# EAGLE design ESP8266_Led_Driver (EAGLE 9.6.2)
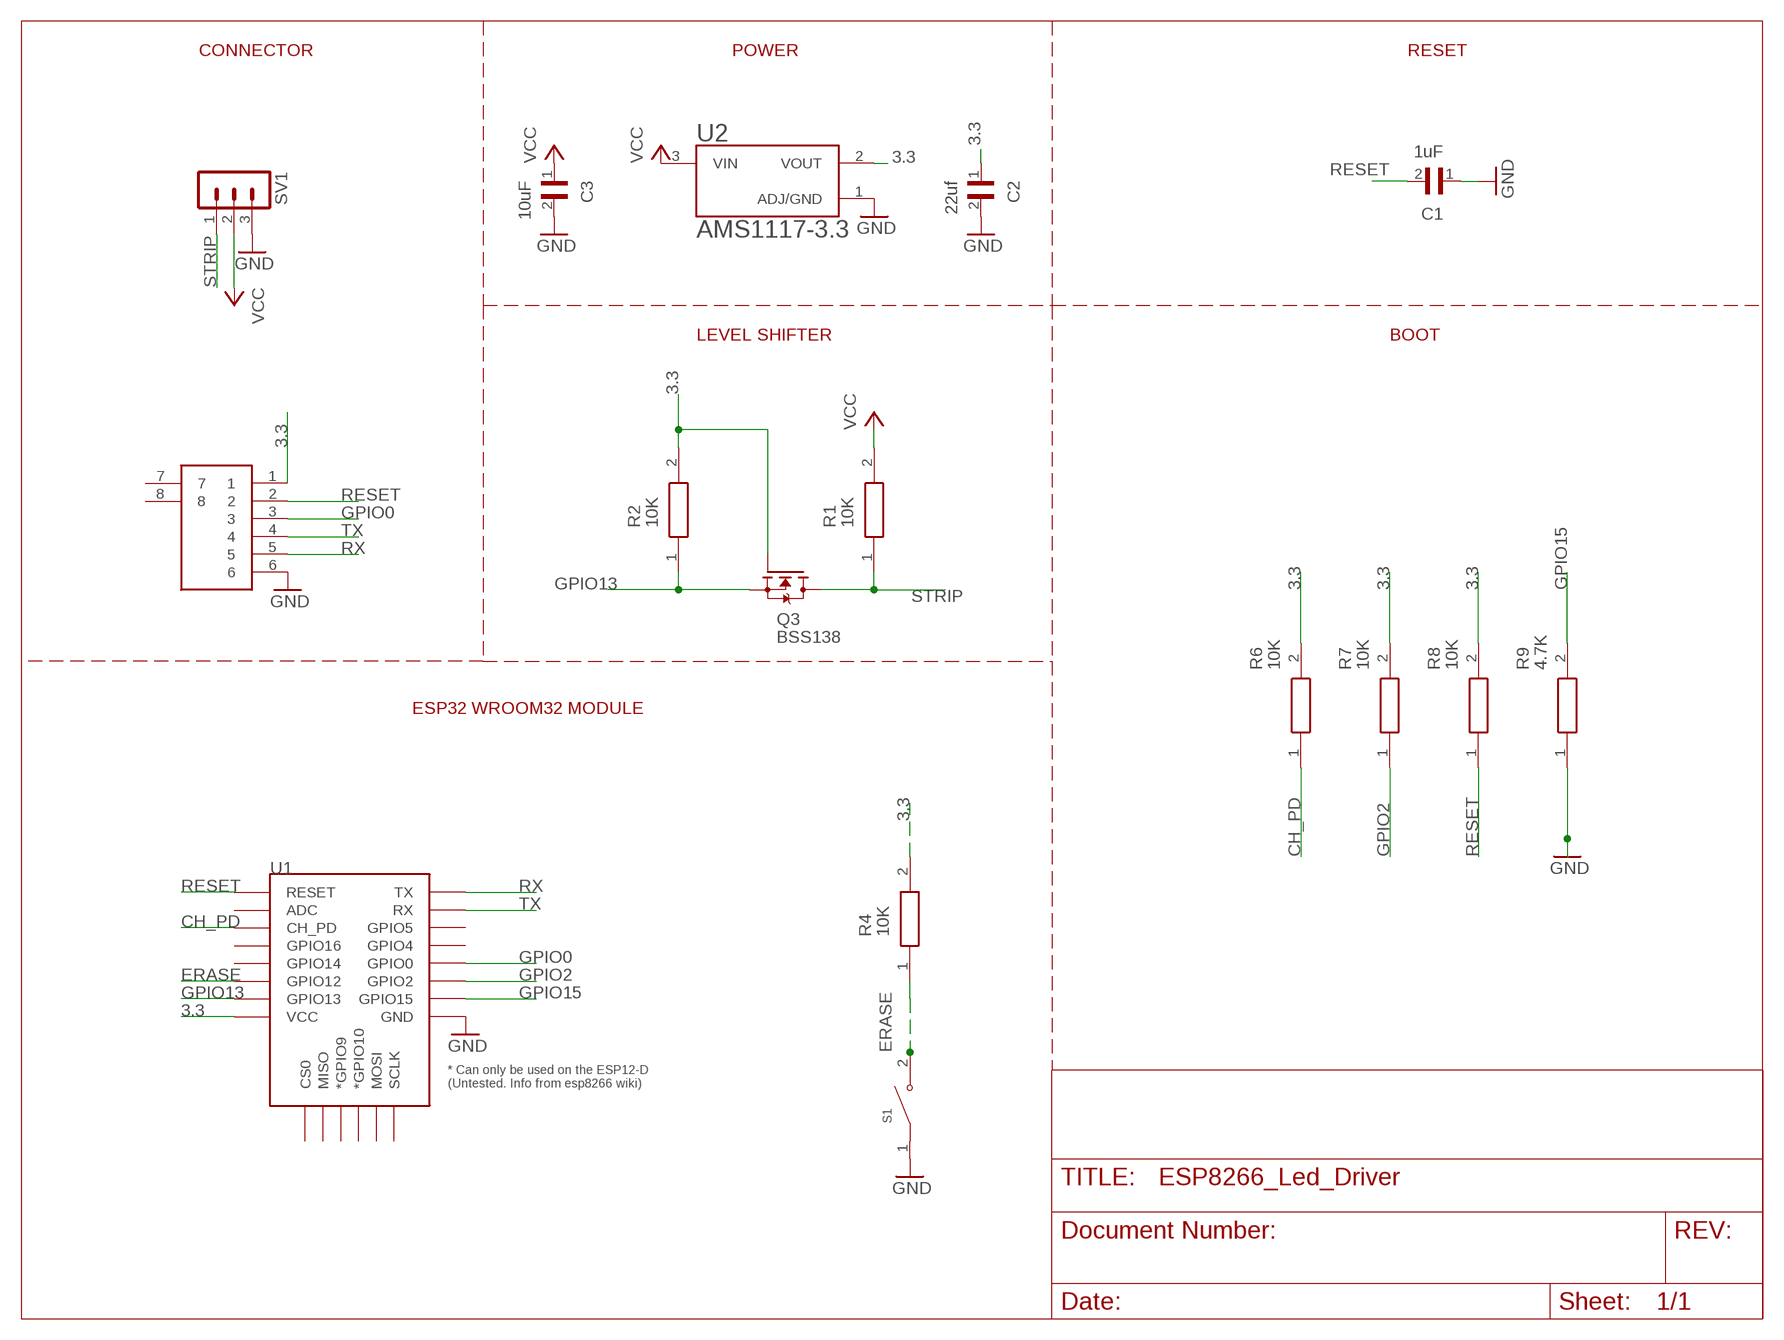
[diagram p0: schematic, sheet 1]

## Parts
C1  1uF  0805YC103J4T2A  [CAPC2012X94N]
C2  22uf  0805YC103J4T2A  [CAPC2012X94N]
C3  10uF  0805YC103J4T2A  [CAPC2012X94N]
J1  52852-0670  [528520670]
Q3  BSS138  [SOT95P240X111-3N]
R1  10K  TNPW060330K0BXEA  [RESC1608X55N]
R2  10K  TNPW060330K0BXEA  [RESC1608X55N]
R4  10K  TNPW060330K0BXEA  [RESC1608X55N]
R6  10K  TNPW060330K0BXEA  [RESC1608X55N]
R7  10K  TNPW060330K0BXEA  [RESC1608X55N]
R8  10K  TNPW060330K0BXEA  [RESC1608X55N]
R9  4.7K  TNPW060330K0BXEA  [RESC1608X55N]
S1  PTS636_SM43J_SMTR_LFS  [SW_PTS636_SM43J_SMTR_LFS]
SV1  MA03-1  [MA03-1]
U1  ESP12ESMD  [ESP12E-SMD]
U2  AMS1117-3.3  [SOT229P700X180-4N]

## Nets
3.3: C2.1 J1.1 Q3.1(G) R2.2 R4.2 R6.2 R7.2 R8.2 U1.VCC U2.2(VOUT)
CH_PD: R6.1 U1.CH_PD
ERASE: R4.1 S1.2(NO) U1.GPIO12
GND: C1.1 C2.2 C3.2 J1.6 R9.1 S1.1(COM) SV1.3 U1.GND U2.1(ADJ/GND)
GPIO0: J1.3 U1.GPIO0
GPIO2: R7.1 U1.GPIO2
GPIO13: Q3.2(S) R2.1 U1.GPIO13
GPIO15: R9.2 U1.GPIO15
RESET: C1.2 J1.2 R8.1 U1.RESET
RX: J1.5 U1.TXD0(TX)
STRIP: Q3.3(D) R1.1 SV1.1
TX: J1.4 U1.RXD0(RX)
VCC: C3.1 R1.2 SV1.2 U2.3(VIN)
Unconnected: J1.7 J1.8 U1.ADC U1.CS0 U1.GPIO4 U1.GPIO5 U1.GPIO9(*GPIO9) U1.GPIO10(*GPIO10) U1.GPIO14 U1.GPIO16 U1.MISO U1.MOSI U1.SCLK

## Notes on the sheet
- CONNECTOR | POWER | RESET
- LEVEL SHIFTER | BOOT
- ESP32 WROOM32 MODULE

## Library data of the parts
C1-C3 = 0805YC103J4T2A:0805YC103J4T2A: Cap Ceramic 0.01uF 16V X7R 5% SMD 0805 125°C Paper T/R Check availability <https://pricing.snapeda.com/parts/0805YC103J4T2A/AVX/view-part?ref=eda>; AVAILABILITY: In Stock; DESCRIPTION: 10000 pF ±5% 16V Ceramic Capacitor X7R 0805 (2012 Metric); MF: AVX; MP: 0805YC103J4T2A; PACKAGE: 2012 AVX; PRICE: None; PURCHASE-URL: https://pricing.snapeda.com/search/part/0805YC103J4T2A/?ref=eda
J1 = 52852-0670:52852-0670: FFC & FPC Connectors 1.0 FFC Non ZIF SMT HsgAssy6CktEmbsTpPkg Source: Datasheet <https://www.molex.com/pdm_docs/sd/528520670_sd.pdf>; DESCRIPTION: FFC & FPC Connectors 1.0 FFC Non ZIF SMT HsgAssy6CktEmbsTpPkg; HEIGHT: 3mm; MANUFACTURER_NAME: Molex; MANUFACTURER_PART_NUMBER: 52852-0670; MOUSER_PART_NUMBER: 538-52852-0670; MOUSER_PRICE-STOCK: https://www.mouser.co.uk/ProductDetail/Molex/52852-0670?qs=%252BdbFUiYBkDZQc5IPgvIwgQ%3D%3D
Q3 = BSS138:BSS138: N-Channel 50V 220mA (Ta) 360mW (Ta) Surface Mount SOT-23-3 Check availability <https://pricing.snapeda.com/parts/BSS138/ON%20Semiconductor/view-part?ref=eda>; AVAILABILITY: In Stock; DESCRIPTION: N-Channel 50 V 200mA (Ta) 225mW (Ta) Surface Mount SOT-23-3 (TO-236); MF: ON Semiconductor; MP: BSS138; PACKAGE: SOT-23 ON; PRICE: None; PURCHASE-URL: https://pricing.snapeda.com/search/part/BSS138/?ref=eda
R1 R2 R4 R6-R9 = TNPW060330K0BXEA:TNPW060330K0BXEA: Thin Film Resistors - SMD TNPW0603 30K 0.1% T-10 ET1 e3 Source: Datasheet; DESCRIPTION: Thin Film Resistors - SMD TNPW0603 30K 0.1% T-10 ET1 e3; HEIGHT: 0.55mm; MANUFACTURER_NAME: Vishay; MANUFACTURER_PART_NUMBER: TNPW060330K0BXEA; MOUSER_PART_NUMBER: 71-TNPW060330K0BXEA; MOUSER_PRICE-STOCK: https://www.mouser.co.uk/ProductDetail/Vishay/TNPW060330K0BXEA?qs=vmHwEFxEFR%252BodANPEwSK8w%3D%3D
S1 = PTS636_SM43J_SMTR_LFS:PTS636_SM43J_SMTR_LFS: Tactile Switch SPST-NO Top Actuated Surface Mount Check availability <https://pricing.snapeda.com/parts/PTS636%20SM43J%20SMTR%20LFS/C%26K/view-part?ref=eda>; AVAILABILITY: In Stock; DESCRIPTION: Tactile Switch SPST-NO Top Actuated Surface Mount; MF: C&K; MP: PTS636 SM43J SMTR LFS; PACKAGE: None; PRICE: None; PURCHASE-URL: https://pricing.snapeda.com/search/part/PTS636 SM43J SMTR LFS/?ref=eda
SV1 = con-lstb:MA03-1: PIN HEADER; OC_FARNELL: unknown; OC_NEWARK: unknown
U1 = esp8266modules:ESP12E: ESP12E Module
U2 = AMS1117-3.3:AMS1117-3.3: Sot223/Pkg 1-Amp 3.3-Volt Low Drop Out Voltage Regulatator Check availability <https://pricing.snapeda.com/parts/AMS1117-3.3/Advanced%20Monolithic%20Systems/view-part?ref=eda>; AVAILABILITY: Not in stock; DESCRIPTION: LDO Voltage Regulators 800MA LDO LINEAR REG; MF: Advanced Monolithic Systems; MP: AMS1117-3.3; PACKAGE: SOT-223 Seeed Technology; PRICE: None

## Board
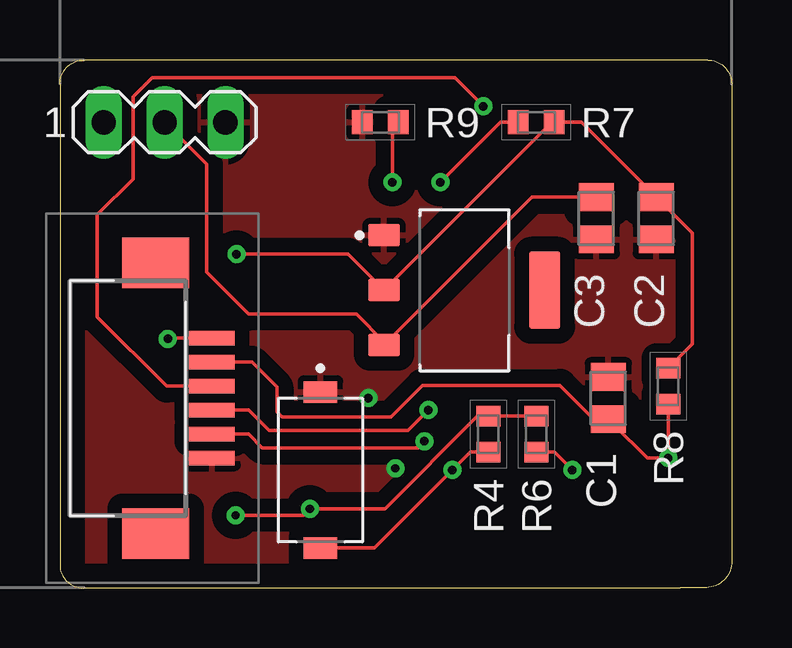
[diagram p1: board, top side]
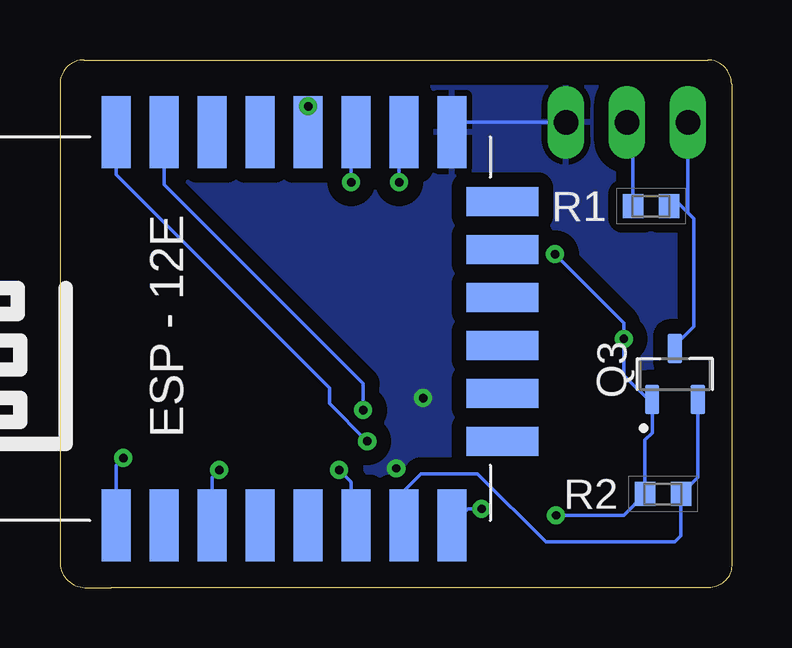
[diagram p2: board, bottom side, seen from below]

Size 28 x 22 mm. Coordinates in mm from the lower left corner, seen from the top.
Outline: 0,21 0,1 arc90 0.86,0 25.86,0 26.86,0 arc90 28,1 28,21 arc90 27,22 1,22 arc90 0,21
Copper layers (1*16): Top 0.035mm / dielectric 1.5mm / Bottom 0.035mm
Design rules "default": minimum track width 6mil, minimum drill 0.35mm, track to track 6mil, track to pad 6mil, pad to pad 6mil, via to via 6mil, smd to smd 6mil, copper to edge 40mil, drill to drill 6mil, minimum pad ring 10mil, minimum via ring 8mil, stop-mask expansion 4mil, vias tented up to drill 0mil, thermal gap 10mil

### Footprints (pad centres in the part's own frame; a part is rotated, then mirrored left to right if it is on the bottom)
CAPC2012X94N = smd 1.16 x 1.47: 1 -0.88,0; 2 0.88,0
528520670 = smd 0.6 x 1.9: 1 -2.5,2.475; 2 -1.5,2.475; 3 -0.5,2.475; 4 0.5,2.475; 5 1.5,2.475; 6 2.5,2.475 | smd 2.1 x 2.8: 7 -5.65,0.125; 8 5.65,0.125
SOT95P240X111-3N = smd 1.23 x 0.6: 1 -1.06,0.95; 2 -1.06,-0.95; 3 1.06,0
RESC1608X55N = smd 0.85 x 1: 1 -0.75,0; 2 0.75,0
SW_PTS636_SM43J_SMTR_LFS = smd 0.9 x 1.4: 1 -3.25,0; 2 3.25,0
MA03-1 = drill 1.016 long: 1 -2.54,0; 2 0,0; 3 2.54,0
ESP12E-SMD = smd 3 x 1.2: ADC -8.3,3.8; CH_PD -8.3,1.8; GND 8.1,-8.2; GPIO0 8.1,-2.2; GPIO2 8.1,-4.2; GPIO4 8.1,-0.2; GPIO5 8.1,1.8; GPIO12 -8.3,-4.2; GPIO13 -8.3,-6.2; GPIO14 -8.3,-2.2; GPIO15 8.1,-6.2; GPIO16 -8.3,-0.2; RESET -8.3,5.8; RXD0 8.1,3.8; TXD0 8.1,5.8; VCC -8.3,-8.2 | smd 1.2 x 3: CS0 -4.8,-10.3; GPIO9 -0.8,-10.3; GPIO10 1.2,-10.3; MISO -2.8,-10.3; MOSI 3.2,-10.3; SCLK 5.2,-10.3
SOT229P700X180-4N = smd 0.93 x 1.31: 1 -2.29,-3.345; 2 0,-3.345; 3 2.29,-3.345 | smd 3.24 x 1.31: 4 0,3.345

### Placement (x,y rotation side)
C1  22.86,7.9 270 top
C2  24.86,15.4 270 top
C3  22.36,15.4 270 top
J1  3.86,7.9 270 top
Q3  2.36,8.9 90 bottom
R1  3.36,15.9 180 bottom
R2  2.86,3.9 180 bottom
R4  17.86,6.4 90 top
R6  19.86,6.4 90 top
R7  19.86,19.4 0 top
R8  25.36,8.4 90 top
R9  13.36,19.4 0 top
S1  10.86,4.9 270 top
SV1  4.36,19.4 0 top
U1  19.86,10.9 90 bottom
U2  16.86,12.4 270 top

### Tracks (layer width: path | path; a pad name or v marks a point on that pad's centre or on a via)
3.3  (via drill 0.35)
  Top 0.152: v4.49,10.37 4.52,10.4 J1.1 | R6.2 R4.2 17.41,7.15 13.54,3.28 v10.42,3.28 10.15,3.01 v7.32,3.01 | R8.2 26.36,10.15 26.36,14.78 C2.1 21.74,19.4 R7.2 20.52,19.4 U2.2 12.02,13.9 v7.36,13.9
  Bottom 0.152: Q3.1 3.31,7.67 | 3.31,7.67 3.31,6.45 3.61,6.15 R2.2 4.5,3.01 v7.32,3.01 | 3.31,7.67 4.49,8.85 v4.49,10.37 4.49,11.03 v7.36,13.9 | v10.42,3.28 10.98,3.28 U1.VCC
CH_PD  (via drill 0.35)
  Top 0.152: v21.36,4.9 20.61,5.65 R6.1
  Bottom 0.152: v21.36,4.9 21.66,4.6 U1.CH_PD
ERASE  (via drill 0.35)
  Top 0.152: R4.1 17.11,5.65 v16.36,4.9 13.11,1.65 S1.2
  Bottom 0.152: v16.36,4.9 15.86,4.4 15.86,2.8 U1.GPIO12
GND  (via drill 0.35)
  Bottom 0.152: U1.GND 11.26,19.4 SV1.3
  other vias: 12.86,7.9 13.98,4.97
  pour Bottom (isolate 0.61): 28.86,22.9 28.86,-1.1 -1.14,-1.1 -1.14,22.9
  pour Top (isolate 0.61): 29.86,23.9 29.86,-2.1 -2.14,-2.1 -2.14,23.9
GPIO0  (via drill 0.35)
  Top 0.152: J1.3 4.45,8.4 1.56,11.29 1.56,15.55 3.04,17.03 3.04,20.47 3.83,21.26 16.46,21.26 v17.65,20.07
  Bottom 0.152: U1.GPIO0 v17.65,20.07
GPIO2  (via drill 0.35)
  Top 0.152: v15.86,16.9 18.36,19.4 R7.1
  Bottom 0.152: v15.86,16.9 15.86,18.8 U1.GPIO2
GPIO13
  Bottom 0.152: Q3.2 1.41,4.6 R2.1 2.11,2.15 2.36,1.9 7.75,1.9 10.59,4.74 12.95,4.74 13.66,4.03 U1.GPIO13
GPIO15  (via drill 0.35)
  Top 0.152: v13.86,16.9 13.86,19.15 R9.2
  Bottom 0.152: v13.86,16.9 13.86,18.8 U1.GPIO15
RESET  (via drill 0.35)
  Top 0.152: R8.1 v25.36,5.4 24.48,5.4 23.07,6.81 | C1.2 23.07,6.81 | J1.2 8,9.4 9.04,8.36 9.04,7.32 9.25,7.11 13.79,7.11 15.11,8.43 20.85,8.43 22.47,6.81 23.07,6.81
  Bottom 0.152: v25.36,5.4 25.66,5.1 U1.RESET
RX  (via drill 0.35)
  Top 0.152: J1.5 7.86,6.4 8.43,5.83 14.92,5.83 v15.19,6.1
  Bottom 0.152: v15.19,6.1 16.77,7.68 16.77,8.32 25.66,17.21 U1.TXD0
STRIP
  Bottom 0.152: SV1.1 1.82,15.63 | 1.82,15.63 2.32,16.13 2.32,15.86 2.57,15.86 R1.1 | 1.82,15.63 1.57,15.38 1.57,10.89 2.36,10.1 Q3.3
TX  (via drill 0.35)
  Top 0.152: v15.36,7.4 14.51,6.55 8.71,6.55 7.86,7.4 J1.4
  Bottom 0.152: v15.36,7.4 15.36,8.51 23.66,16.81 U1.RXD0
VCC
  Top 0.152: SV1.2 6.11,17.65 6.11,13.15 7.86,11.4 12.36,11.4 13.52,10.25 U2.3 19.69,16.28 C3.1
  Bottom 0.152: SV1.2 4.11,19.15 R1.2